# EAGLE board metronome (EAGLE 6.6.0)
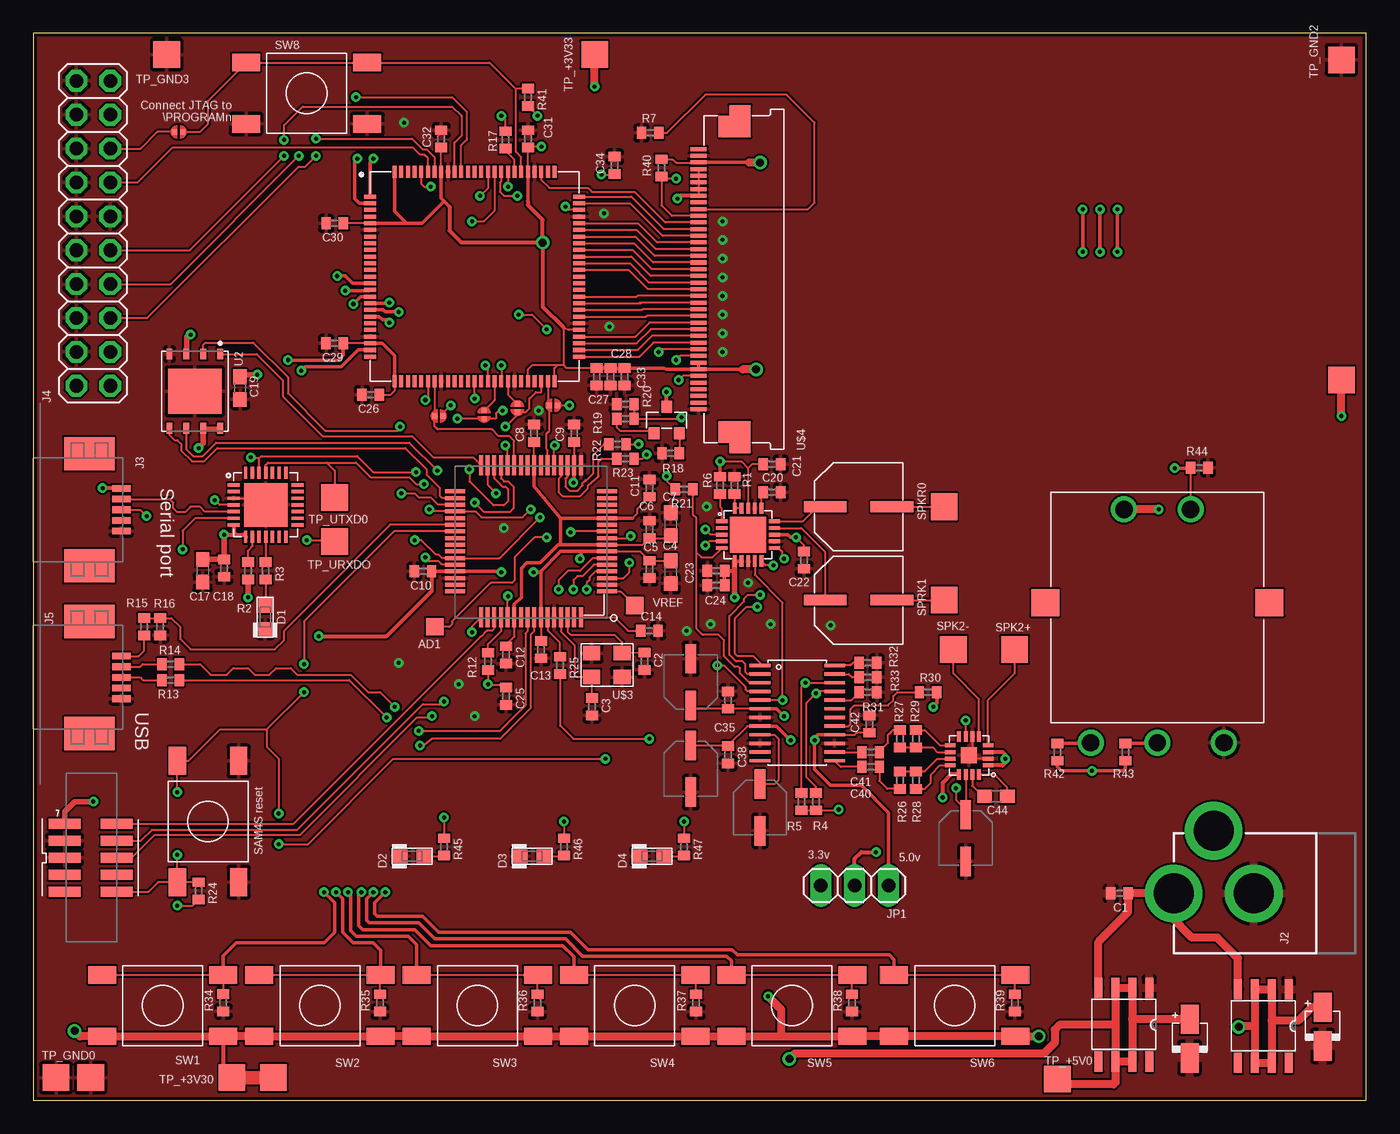
[diagram p5: board, top side]
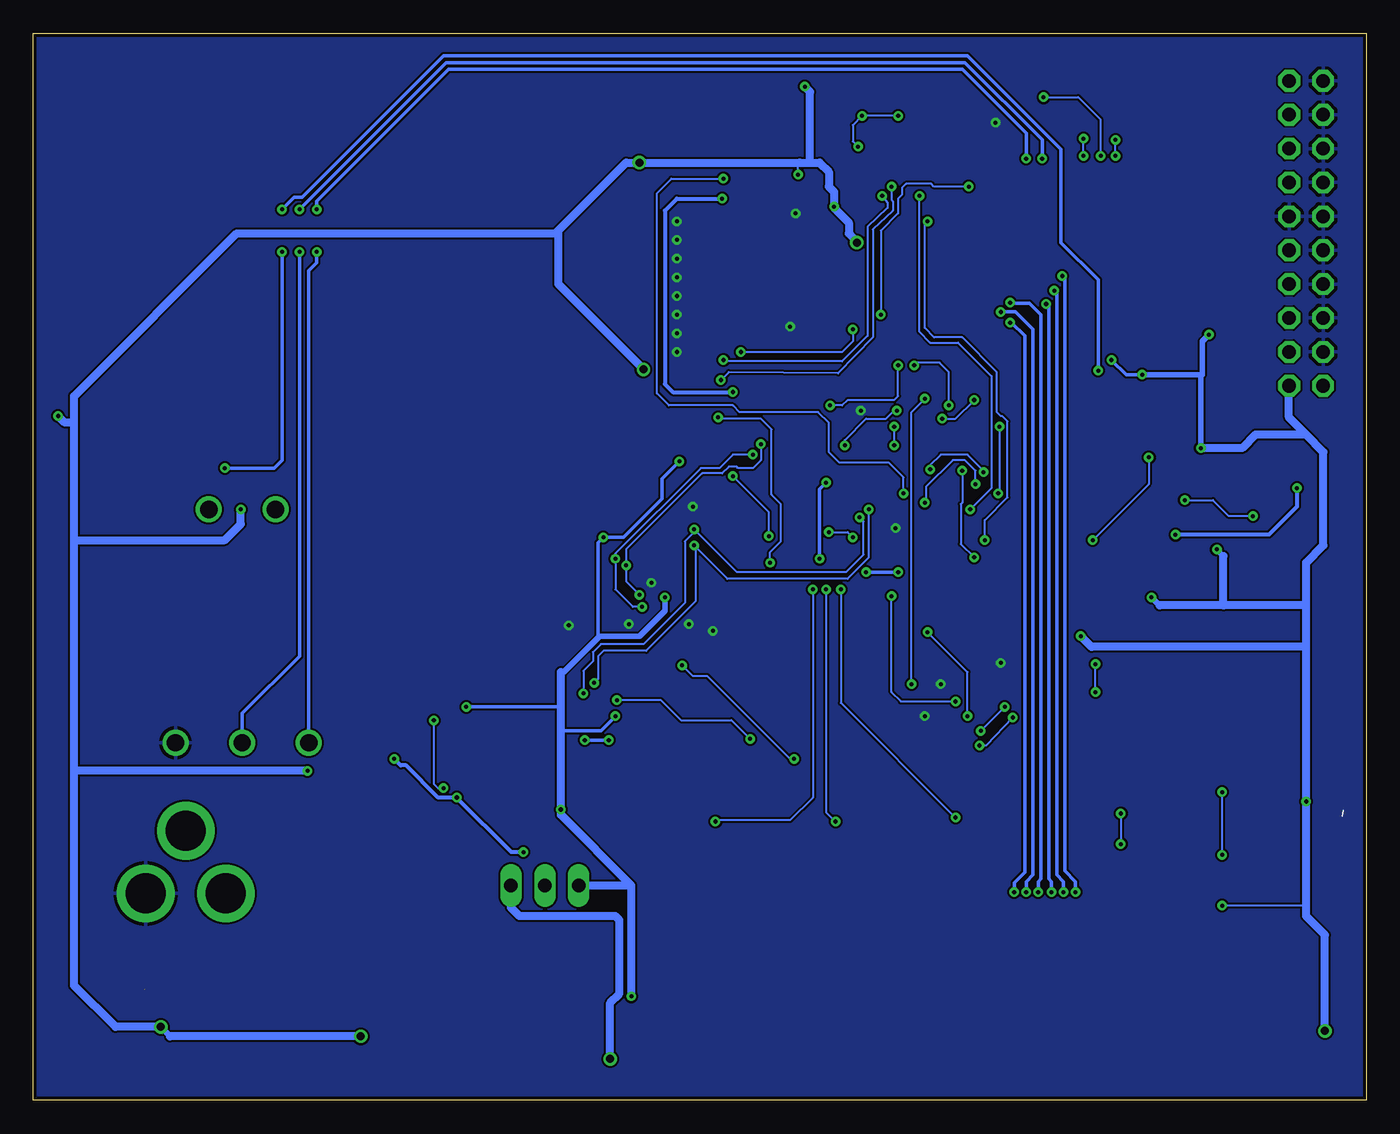
[diagram p6: board, bottom side, seen from below]

Size 99.96 x 79.99 mm. Coordinates in mm from the lower left corner, seen from the top.
Outline: 0,0 99.96,0 99.96,79.99 0,79.99 0,0
Copper layers (1*16): Top 0.035mm / dielectric 1.5mm / Bottom 0.035mm
Design rules "DFRobot_Eagle_Rule_v0.4": minimum track width 6mil, minimum drill 12mil, track to track 6mil, track to pad 6mil, pad to pad 6mil, via to via 6mil, smd to smd 0mil, copper to edge 10mil, drill to drill 10mil, minimum pad ring 12mil, minimum via ring 8mil, stop-mask expansion 2mil, vias tented up to drill 25mil, thermal gap 10mil

## Footprints (pad centres in the part's own frame; a part is rotated, then mirrored left to right if it is on the bottom)
ON_SEMICONDUCTOR_MC33269 = smd 0.6 x 1.52: P$1 0,-5.52; P$2 1.27,-5.52; P$3 2.54,-5.52; P$4 3.81,-5.52; P$5 3.81,0; P$6 2.54,0; P$7 1.27,0; P$8 0,0
TP13SQ = smd 1.3 x 1.3: TP 0,0
C0402 = smd 0.7 x 0.9: 1 -0.65,0; 2 0.65,0
C0603 = smd 1.1 x 1: 1 -0.85,0; 2 0.85,0
KEMET_T491A = smd 2.2 x 1.35: NEG 0,0; POS 2.9,0
PANASONIC_EEEHB100AR = smd 0.8 x 2.2: NEG 0,0; POS 0,-3.5
D0603 = smd 1 x 1.09: AN 0,-0.89; CATH 0,0.89
FCI_10_PIN_SMD_0.5 = smd 0.76 x 2.4: P$1 0,-3.9; P$2 0,0; P$3 1.27,-3.9; P$4 1.27,0; P$5 2.54,-3.9; P$6 2.54,0; P$7 3.81,-3.9; P$8 3.81,0; P$9 5.08,-3.9; P$10 5.08,0
POWER_JACK_PTH = drill 2.997 pad 4.318: GND 0,7.7; GNDBREAK 4.7,10.7; PWR 0,13.7
UX60SC-MB-5ST = smd 2.5 x 3.8: M$1 -4.2,3.7; M$2 4.2,3.7 | smd 0.5 x 1.4: P$1 -1.6,6.1; P$2 -0.8,6.1; P$3 0,6.1; P$4 0.8,6.1; P$5 1.6,6.1
2X10 = drill 1.016 octagon: 1 -11.43,-1.27; 2 -11.43,1.27; 3 -8.89,-1.27; 4 -8.89,1.27; 5 -6.35,-1.27; 6 -6.35,1.27; 7 -3.81,-1.27; 8 -3.81,1.27; 9 -1.27,-1.27; 10 -1.27,1.27; 11 1.27,-1.27; 12 1.27,1.27; 13 3.81,-1.27; 14 3.81,1.27; 15 6.35,-1.27; 16 6.35,1.27; 17 8.89,-1.27; 18 8.89,1.27; 19 11.43,-1.27; 20 11.43,1.27
1X03 = drill 1.016 long: 1 -2.54,0; 2 0,0; 3 2.54,0
R0402 = smd 0.7 x 0.9: 1 -0.65,0; 2 0.65,0
SB_1MM = smd 0.4 x 0.4: P$1 -0.3,0; P$2 0.3,0
TP20SQ = smd 2 x 2: TP 0,0
FSMJSMA = smd 1.3 x 2.1: P$1 -2.3,4.55; P$2 -2.3,-4.55; P$3 2.3,4.55; P$4 2.3,-4.55
ATMEL_10X10_QFP_64 = smd 1.5 x 0.3: P$1 0,0; P$2 0,-0.5; P$3 0,-1; P$4 0,-1.5; P$5 0,-2; P$6 0,-2.5; P$7 0,-3; P$8 0,-3.5; P$9 0,-4; P$10 0,-4.5; P$11 0,-5; P$12 0,-5.5; P$13 0,-6; P$14 0,-6.5; P$15 0,-7; P$16 0,-7.5; P$33 11.4,-7.5; P$34 11.4,-7; P$35 11.4,-6.5; P$36 11.4,-6; P$37 11.4,-5.5; P$38 11.4,-5; P$39 11.4,-4.5; P$40 11.4,-4; P$41 11.4,-3.5; P$42 11.4,-3; P$43 11.4,-2.5; P$44 11.4,-2; P$45 11.4,-1.5; P$46 11.4,-1; P$47 11.4,-0.5; P$48 11.4,0 | smd 0.3 x 1.5: P$17 1.95,-9.45; P$18 2.45,-9.45; P$19 2.95,-9.45; P$20 3.45,-9.45; P$21 3.95,-9.45; P$22 4.45,-9.45; P$23 4.95,-9.45; P$24 5.45,-9.45; P$25 5.95,-9.45; P$26 6.45,-9.45; P$27 6.95,-9.45; P$28 7.45,-9.45; P$29 7.95,-9.45; P$30 8.45,-9.45; P$31 8.95,-9.45; P$32 9.45,-9.45; P$49 9.45,1.95; P$50 8.95,1.95; P$51 8.45,1.95; P$52 7.95,1.95; P$53 7.45,1.95; P$54 6.95,1.95; P$55 6.45,1.95; P$56 5.95,1.95; P$57 5.45,1.95; P$58 4.95,1.95; P$59 4.45,1.95; P$60 3.95,1.95; P$61 3.45,1.95; P$62 2.95,1.95; P$63 2.45,1.95; P$64 1.95,1.95
8MA1-UDFN = smd 0.44 x 0.82: P$1 -1.905,-2.79; P$2 -0.635,-2.79; P$3 0.635,-2.79; P$4 1.905,-2.79; P$5 1.905,2.79; P$6 0.635,2.79; P$7 -0.635,2.79; P$8 -1.905,2.79 | smd 4 x 3.4: P$9 0,0
LATTICE_MACHXO_TQFP100 = smd 0.9 x 0.3: P$1 0,0; P$2 0,-0.5; P$3 0,-1; P$4 0,-1.5; P$5 0,-2; P$6 0,-2.5; P$7 0,-3; P$8 0,-3.5; P$9 0,-4; P$10 0,-4.5; P$11 0,-5; P$12 0,-5.5; P$13 0,-6; P$14 0,-6.5; P$15 0,-7; P$16 0,-7.5; P$17 0,-8; P$18 0,-8.5; P$19 0,-9; P$20 0,-9.5; P$21 0,-10; P$22 0,-10.5; P$23 0,-11; P$24 0,-11.5; P$25 0,-12; P$51 15.7,-12; P$52 15.7,-11.5; P$53 15.7,-11; P$54 15.7,-10.5; P$55 15.7,-10; P$56 15.7,-9.5; P$57 15.7,-9; P$58 15.7,-8.5; P$59 15.7,-8; P$60 15.7,-7.5; P$61 15.7,-7; P$62 15.7,-6.5; P$63 15.7,-6; P$64 15.7,-5.5; P$65 15.7,-5; P$66 15.7,-4.5; P$67 15.7,-4; P$68 15.7,-3.5; P$69 15.7,-3; P$70 15.7,-2.5; P$71 15.7,-2; P$72 15.7,-1.5; P$73 15.7,-1; P$74 15.7,-0.5; P$75 15.7,0 | smd 0.3 x 0.9: P$26 1.85,-13.85; P$27 2.35,-13.85; P$28 2.85,-13.85; P$29 3.35,-13.85; P$30 3.85,-13.85; P$31 4.35,-13.85; P$32 4.85,-13.85; P$33 5.35,-13.85; P$34 5.85,-13.85; P$35 6.35,-13.85; P$36 6.85,-13.85; P$37 7.35,-13.85; P$38 7.85,-13.85; P$39 8.35,-13.85; P$40 8.85,-13.85; P$41 9.35,-13.85; P$42 9.85,-13.85; P$43 10.35,-13.85; P$44 10.85,-13.85; P$45 11.35,-13.85; P$46 11.85,-13.85; P$47 12.35,-13.85; P$48 12.85,-13.85; P$49 13.35,-13.85; P$50 13.85,-13.85; P$76 13.85,1.85; P$77 13.35,1.85; P$78 12.85,1.85; P$79 12.35,1.85; P$80 11.85,1.85; P$81 11.35,1.85; P$82 10.85,1.85; P$83 10.35,1.85; P$84 9.85,1.85; P$85 9.35,1.85; P$86 8.85,1.85; P$87 8.35,1.85; P$88 7.85,1.85; P$89 7.35,1.85; P$90 6.85,1.85; P$91 6.35,1.85; P$92 5.85,1.85; P$93 5.35,1.85; P$94 4.85,1.85; P$95 4.35,1.85; P$96 3.85,1.85; P$97 3.35,1.85; P$98 2.85,1.85; P$99 2.35,1.85; P$100 1.85,1.85
TI_QFN_20 = smd 0.85 x 0.28: 1 -0.975,-0.975; 2 -0.975,-1.475; 3 -0.975,-1.975; 4 -0.975,-2.475; 5 -0.975,-2.975; 11 2.975,-2.975; 12 2.975,-2.475; 13 2.975,-1.975; 14 2.975,-1.475; 15 2.975,-0.975 | smd 0.28 x 0.85: 6 0,-3.95; 7 0.5,-3.95; 8 1,-3.95; 9 1.5,-3.95; 10 2,-3.95; 16 2,0; 17 1.5,0; 18 1,0; 19 0.5,0; 20 0,0 | smd 2.7 x 2.7: GND_PAD 1,-1.975
ECS_ECX-32 = smd 1.3 x 1.1: P$1 0,-1.8; P$2 2.3,-1.8; P$3 2.3,0; P$4 0,0
40_PIN_MOLEX_FFC = smd 1.6 x 0.8: NC@0 -1.7,-1.9; NC@2 21.2,-1.9 | smd 2.4 x 1.6: NC@1 -2.1,-3.1; NC@3 21.6,-3.1 | smd 0.3 x 1.2: P$1 0,0; P$2 0.5,0; P$3 1,0; P$4 1.5,0; P$5 2,0; P$6 2.5,0; P$7 3,0; P$8 3.5,0; P$9 4,0; P$10 4.5,0; P$11 5,0; P$12 5.5,0; P$13 6,0; P$14 6.5,0; P$15 7,0; P$16 7.5,0; P$17 8,0; P$18 8.5,0; P$19 9,0; P$20 9.5,0; P$21 10,0; P$22 10.5,0; P$23 11,0; P$24 11.5,0; P$25 12,0; P$26 12.5,0; P$27 13,0; P$28 13.5,0; P$29 14,0; P$30 14.5,0; P$31 15,0; P$32 15.5,0; P$33 16,0; P$34 16.5,0; P$35 17,0; P$36 17.5,0; P$37 18,0; P$38 18.5,0; P$39 19,0; P$40 19.5,0
DIODES_INCORPORATED_SOT23 = smd 0.8 x 0.9: P$1 -0.95,-2; P$2 0.95,-2; P$3 0,0
PANASONIC_EEEFT0JXXX = smd 0.8 x 3.2: NEG 0,0.3; POS 0,-4.7
SILABS_QFN28 = smd 3.25 x 3.25: GND_PAD 2.4,-1.5 | smd 0.9 x 0.25: P$1 0,0; P$2 0,-0.5; P$3 0,-1; P$4 0,-1.5; P$5 0,-2; P$6 0,-2.5; P$7 0,-3; P$15 4.8,-3; P$16 4.8,-2.5; P$17 4.8,-2; P$18 4.8,-1.5; P$19 4.8,-1; P$20 4.8,-0.5; P$21 4.8,0 | smd 0.25 x 0.9: P$8 0.9,-3.9; P$9 1.4,-3.9; P$10 1.9,-3.9; P$11 2.4,-3.9; P$12 2.9,-3.9; P$13 3.4,-3.9; P$14 3.9,-3.9; P$22 3.9,0.9; P$23 3.4,0.9; P$24 2.9,0.9; P$25 2.4,0.9; P$26 1.9,0.9; P$27 1.4,0.9; P$28 0.9,0.9
TI_PW_TSSOP_24 = smd 0.25 x 1.55: P$1 0,-5.6; P$2 0.65,-5.6; P$3 1.3,-5.6; P$4 1.95,-5.6; P$5 2.6,-5.6; P$6 3.25,-5.6; P$7 3.9,-5.6; P$8 4.55,-5.6; P$9 5.2,-5.6; P$10 5.85,-5.6; P$11 6.5,-5.6; P$12 7.15,-5.6; P$13 7.15,0; P$14 6.5,0; P$15 5.85,0; P$16 5.2,0; P$17 4.55,0; P$18 3.9,0; P$19 3.25,0; P$20 2.6,0; P$21 1.95,0; P$22 1.3,0; P$23 0.65,0; P$24 0,0
MAXIM_16_TQFN_T1633-5 = smd 0.8 x 0.3: P$1 0,0; P$2 0,-0.5; P$3 0,-1; P$4 0,-1.5; P$9 2.85,-1.5; P$10 2.85,-1; P$11 2.85,-0.5; P$12 2.85,0 | smd 0.3 x 0.8: P$5 0.675,-2.175; P$6 1.175,-2.175; P$7 1.675,-2.175; P$8 2.175,-2.175; P$13 2.175,0.675; P$14 1.675,0.675; P$15 1.175,0.675; P$16 0.675,0.675 | smd 1.2 x 1.2: P$17 1.425,-0.75
BOURNS_PEC16-4XXXF-SXXXX = drill 1.3: A -5,-10.5; B 0,-10.5; C 5,-10.5; D -2.5,7; E 2.5,7 | smd 2.1 x 2: NC1 -8.4,0; NC2 8.4,0

## Placement (x,y rotation side)
3.3_V_REG  MC33269D-3.3GOS-ND  [ON_SEMICONDUCTOR_MC33269]  94.15,2.81 180 top
5.0_V_REG  MC33269D-5.0GOS-ND  [ON_SEMICONDUCTOR_MC33269]  83.69,2.91 180 top
AD1  TPSQTP13SQ  [TP13SQ]  30.1,35.5 180 top
C1  330nF  [C0402]  81.45,15.51 180 top
C2  16pF  [C0402]  45.83,32.92 270 top
C3  16pF  [C0402]  41.9,29.51 270 top
C4  4.7uF  [C0603]  47.8,39.6 270 top
C5  100nF  [C0402]  46.2,39.8 270 top
C6  100nF  [C0402]  46.2,42.8 90 top
C7  2.2uF  [C0603]  47.8,43.2 90 top
C8  100nF  [C0402]  37.57,50.02 90 top
C9  100nF  [C0402]  40.57,50.01 90 top
C10  100nF  [C0402]  29.22,39.65 180 top
C11  100nF  [C0402]  46.2,45.9 90 top
C12  100nF  [C0402]  35.47,33.39 270 top
C13  100nF  [C0402]  38.07,33.79 270 top
C14  100nF  [C0402]  46.2,35.2 0 top
C15  KEMET_T491A  [KEMET_T491A]  86.73,3.18 90 top
C16  KEMET_T491A  [KEMET_T491A]  96.69,4.08 90 top
C17  2.2uF  [C0603]  12.7,39.7 270 top
C18  100nF  [C0402]  14.3,39.9 270 top
C19  2.2uF  [C0603]  15.5,53.4 270 top
C20  4.7uF  [C0402]  55.4,45.6 0 top
C21  4.7uF  [C0402]  55.4,47.7 180 top
C22  4.7uF  [C0402]  57.8,40.5 90 top
C23  1uF  [C0402]  51.2,39.7 0 top
C24  100nF  [C0402]  51.2,38.6 0 top
C25  22pF  [C0402]  35.47,30.29 270 top
C26  100nF  [C0402]  25.3,52.9 180 top
C27  100nF  [C0402]  42.26,54.25 270 top
C28  100nF  [C0402]  43.3,54.25 270 top
C29  100nF  [C0402]  22.6,56.75 180 top
C30  100nF  [C0402]  22.61,65.75 180 top
C31  100nF  [C0402]  37.09,72.07 90 top
C32  100nF  [C0402]  30.59,72.07 90 top
C33  100nF  [C0402]  44.34,54.24 270 top
C34  100nF  [C0402]  43.6,70.1 90 top
C35  1uF  [C0402]  52.1,30 90 top
C36  10uF  [PANASONIC_EEEHB100AR]  49.3,33.1 0 top
C37  10uF  [PANASONIC_EEEHB100AR]  49.3,23.1 180 top
C38  1uF  [C0402]  52.1,25.9 270 top
C39  10uF  [PANASONIC_EEEHB100AR]  54.5,20.2 180 top
C40  .33uF  [C0402]  62.8,25 0 top
C41  .33uF  [C0402]  62.8,26.1 0 top
C42  1uF  [C0402]  62.7,28.2 90 top
C43  10uF  [PANASONIC_EEEHB100AR]  69.93,17.91 180 top
C44  4.7uF  [C0603]  72.2,22.8 180 top
D1  BLUE  [D0603]  17.4,36.2 180 top
D2  BLUE  [D0603]  28.4,18.3 90 top
D3  BLUE  [D0603]  37.4,18.3 90 top
D4  BLUE  [D0603]  46.4,18.3 90 top
J1  FCI_CORTEX_SWD_CONNECTOR  [FCI_10_PIN_SMD_0.5]  6.25,20.72 270 top
J2  POWER_JACKPTH  [POWER_JACK_PTH]  99.23,15.51 90 top
J3  MINI_USB_B  [UX60SC-MB-5ST]  0.5,44.27 270 top
J4  [2X10]  4.5,65 90 top
J5  MINI_USB_B  [UX60SC-MB-5ST]  0.5,31.7 270 top
JP1  [1X03]  61.6,16.1 180 top
R1  10kOhm  [R0402]  52.6,46.1 90 top
R2  1kOhm  [R0402]  16.1,39.7 270 top
R3  100Ohm  [R0402]  17.42,39.7 270 top
R4  2kOhm  [R0402]  58.7,22.4 270 top
R5  2kOhm  [R0402]  57.6,22.4 270 top
R6  10kOhm  [R0402]  51.5,46.1 270 top
R7  1kOhm  [R0402]  46.26,72.54 0 top
R12  22Ohm  [R0402]  34.1,32.9 270 top
R13  27Ohm  [R0402]  10.3,31.5 180 top
R14  27Ohm  [R0402]  10.3,32.7 180 top
R15  27kOhm  [R0402]  8.3,35.5 270 top
R16  47kOhm  [R0402]  9.5,35.5 90 top
R17  2kOhm  [R0402]  35.4,72 270 top
R18  100Ohm  [R0402]  47.8,48.5 0 top
R19  100Ohm  [R0402]  44.4,51.1 0 top
R20  100kOhm  [R0402]  44.4,52.2 180 top
R21  22Ohm  [R0402]  48.8,45.8 180 top
R22  22Ohm  [R0402]  43.8,49.2 180 top
R23  22Ohm  [R0402]  44.4,48.1 180 top
R24  10kOhm  [R0402]  12.4,15.7 270 top
R25  22Ohm  [R0402]  39.5,32.6 270 top
R26  10kOhm  [R0402]  65,24 270 top
R27  10kOhm  [R0402]  65,27.1 90 top
R28  20kOhm  [R0402]  66.2,24 270 top
R29  20kOhm  [R0402]  66.2,27.1 90 top
R30  10kOhm  [R0402]  67.1,30.6 0 top
R31  220kOhm  [R0402]  62.6,30.6 0 top
R32  10kOhm  [R0402]  62.6,32.8 0 top
R33  10kOhm  [R0402]  62.6,31.7 0 top
R34  10kOhm  [R0402]  14.25,7.31 90 top
R35  10kOhm  [R0402]  26,7.3 90 top
R36  10kOhm  [R0402]  37.8,7.3 90 top
R37  10kOhm  [R0402]  49.7,7.3 90 top
R38  10kOhm  [R0402]  61.4,7.3 90 top
R39  10kOhm  [R0402]  73.6,7.3 90 top
R40  10kOhm  [R0402]  47.1,69.9 90 top
R41  10kOhm  [R0402]  37.1,75.2 270 top
R42  10kOhm  [R0402]  76.8,26.1 270 top
R43  10kOhm  [R0402]  81.9,26.1 270 top
R44  10kOhm  [R0402]  87.45,47.41 180 top
R45  100Ohm  [R0402]  30.8,19 270 top
R46  100Ohm  [R0402]  39.8,19 270 top
R47  100Ohm  [R0402]  48.8,19 270 top
SB1  SB_1MM  [SB_1MM]  30.4,51.3 0 top
SB2  SB_1MM  [SB_1MM]  33.8,51.4 90 top
SB3  SB_1MM  [SB_1MM]  39,52.1 0 top
SB4  SB_1MM  [SB_1MM]  36.3,51.9 90 top
SB5  SB_1MM  [SB_1MM]  10.9,72.6 180 top
SPK2+  TPSQTP20SQ  [TP20SQ]  73.6,33.8 180 top
SPK2-  TPSQTP20SQ  [TP20SQ]  69,33.8 180 top
SPKR0  TPSQTP20SQ  [TP20SQ]  68.3,44.5 90 top
SPRK1  TPSQTP20SQ  [TP20SQ]  68.3,37.5 90 top
SW1  [FSMJSMA]  9.7,7.1 90 top
SW2  [FSMJSMA]  21.5,7.1 90 top
SW3  [FSMJSMA]  33.3,7.1 90 top
SW4  [FSMJSMA]  45.1,7.1 90 top
SW5  [FSMJSMA]  56.9,7.1 90 top
SW6  [FSMJSMA]  69.1,7.1 90 top
SW7  [FSMJSMA]  13.1,20.9 180 top
SW8  [FSMJSMA]  20.5,75.5 270 top
TP_+3V30  TPSQTP20SQ  [TP20SQ]  14.9,1.7 0 top
TP_+3V31  TPSQTP20SQ  [TP20SQ]  18,1.7 0 top
TP_+3V32  TPSQTP20SQ  [TP20SQ]  98.1,54 90 top
TP_+3V33  TPSQTP20SQ  [TP20SQ]  42.1,78.4 180 top
TP_+5V0  TPSQTP20SQ  [TP20SQ]  76.8,1.6 0 top
TP_GND0  TPSQTP20SQ  [TP20SQ]  1.7,1.7 0 top
TP_GND1  TPSQTP20SQ  [TP20SQ]  4.3,1.7 0 top
TP_GND2  TPSQTP20SQ  [TP20SQ]  98.1,78 90 top
TP_GND3  TPSQTP20SQ  [TP20SQ]  10,78.4 180 top
TP_URXDO  TPSQTP20SQ  [TP20SQ]  22.6,41.9 180 top
TP_UTXD0  TPSQTP20SQ  [TP20SQ]  22.6,45.2 180 top
U1  ATSAMD4S2BA-AU  [ATMEL_10X10_QFP_64]  43.02,38.15 180 top
U2  [8MA1-UDFN]  12.11,53.16 180 top
U$1  LATTICE_LCMXO2-640HC-4TG100C  [LATTICE_MACHXO_TQFP100]  25.24,67.75 0 top
U$2  TI_PCM1774  [TI_QFN_20]  52.61,44.38 0 top
U$3  ECS_ECS-120-20-33-CKM-TR  [ECS_ECX-32]  44.16,31.73 180 top
U$4  40_PIN_MOLEX_FFC  [40_PIN_MOLEX_FFC]  49.9,51.81 90 top
U$5  DIODES_INCORPORATED_2N7002-7-F  [DIODES_INCORPORATED_SOT23]  47.5,52 0 top
U$6  330uF  [PANASONIC_EEEFT0JXXX]  64.1,44.5 270 top
U$7  SILABS_CP2102  [SILABS_QFN28]  15.03,46.14 0 top
U$8  330uF  [PANASONIC_EEEFT0JXXX]  64.1,37.5 270 top
U$9  TI_PCM1789  [TI_PW_TSSOP_24]  60.1,32.6 270 top
U$10  MAXIM_MAX_98307  [MAXIM_16_TQFN_T1633-5]  71.6,25.1 180 top
U$11  BOURNS_PEC16-4215F-S0024  [BOURNS_PEC16-4XXXF-SXXXX]  84.3,37.3 0 top
VREF  TPSQTP13SQ  [TP13SQ]  45.1,37.1 0 top

## Tracks (layer width: path | path; a pad name or v marks a point on that pad's centre or on a via)
!DISP_READ!
  Top 0.152: U$1.P$53 45.25,56.75 46.31,57.81 U$4.P$13
!DISP_RESET!  (via drill 0.3)
  Top 0.152: U$4.P$30 47.89,66.31 47.1,67.1 R40.1 47.25,69.1 v48.2,69.1 | U1.P$31 34.07,46.13 v34.7,45.5
  Bottom 0.152: v34.7,45.5 34.7,46.7 35.8,47.8 39.5,47.8 40.3,48.6 40.3,50.8 41.1,51.6 47,51.6 47.5,52.1 52.3,52.1 53.2,53 53.2,68 52.1,69.1 v48.2,69.1
!DISP_WRITE!
  Top 0.152: U$4.P$12 46.41,57.31 45.35,56.25 U$1.P$52
+3V3  (via drill 0.3, 0.6)  (1 unrouted)
  Top 0.152: U$7.P$6 12.14,43.64 11.2,42.7 v11.2,41.3 | C9.1 U1.P$18 | U1.P$18 | C10.1 | U1.P$58 C13.1 | C4.1 C5.1 45.5,41.15 U1.P$7 | v10.8,14.6 11.95,14.6 R24.2 | U$1.P$93 C32.1 | U$1.P$80 C31.1 37.16,71.5 v38.1,71.5 | U$1.P$5 C30.1 | C30.1 | U$1.P$23 C29.1 | C26.1 26.8,52.9 27.09,53.19 U$1.P$26 | C27.1 40,54.9 39.8,55.1 | 39.8,55.1 39.3,55.1 | U$1.P$50 39.09,54.89 39.3,55.1 | 39.3,55.1 37.4,55.1 37.09,54.79 U$1.P$46 | 39.8,55.1 39.8,57.9 40.15,57.75 U$1.P$55 | U$1.P$73 40.15,66.75 v39.9,67 | v42.6,69.4 43.55,69.4 C34.1 | R17.1 35.4,73.5 v35.1,73.8 | R41.2 37.1,74.5 v37.8,73.8 | R40.2 47.95,70.55 48.2,70.3 U$4.P$38 | v51.5,47.9 53.1,47.9 53.6,47.4 | 53.6,47.4 U$2.18 | U$9.P$6 C35.1 49.55,29.35 C36.POS | R5.2 R4.2 60.35,21.75 v60.4,21.8 | C21.2 53.9,47.7 53.6,47.4 | 57.3,42.1 v57.2,42.2 57.8,41.6 C22.2
  Top 0.254: U$4.P$38 53.69,70.31 53.7,70.3 | U$4.P$7 53.19,54.81 53.2,54.8 | U$4.P$8 U$4.P$7 | C33.1 47.29,54.89 47.5,54.8 U$4.P$7 | U$1.P$80 37.09,67.41 | U$1.P$93 30.59,67.61 30.8,67.4 | 30.8,67.4 31.2,67 | U$1.P$5 28,65.75 | 28,65.75 29.15,65.75 30.8,67.4 | U$1.P$26 27.09,55.81 26.15,56.75 U$1.P$23 | U$1.P$100 27.09,66.66 28,65.75 | U1.P$58 38.07,39.67 | 38.07,39.67 39.55,41.15 41.07,41.15 | U1.P$7 41.07,41.15 | 41.07,41.15 41.07,40.67 v41,40.6 | U1.P$18 40.57,46.37 v40.5,46.3 | v51.5,47.9 R6.1 | C29.1 23.25,55.85 22.9,55.5 v19.1,55.5 | U$2.6 U$2.7 | v57.2,42.2 56.8,42.2 56.6,42.4 U$2.13 | U$9.P$6 55.75,29.35 v56.3,28.8 | C10.1 U1.P$45 35.05,39.65 v35.1,39.6 | R42.2 76.8,25 77.1,24.7 v79.4,24.7 81.7,24.7 81.9,24.9 R43.2 | R30.2 67.75,29.75 v67.5,29.5 | v37.5,39.6 38,39.6 38.07,39.67
  Top 0.305: 92.9,8.35 3.3_V_REG.P$2 | 3.3_V_REG.P$6 91.79,2.81 91.8,2.8 | 3.3_V_REG.P$7 | 91.61,8.31 91.7,8.4 | C27.1 C28.1 C33.1 | U2.P$7 U2.P$8 | SW1.P$2 14.25,2.35 TP_+3V30.TP | 39.8,57.9 38.2,59.5 v38.2,64.3 | 31.2,67 31.2,65.2 32.1,64.3 v38.2,64.3 | 37.09,67.41 37.09,67.11 38.2,66 v38.2,64.3 | v21.4,34.8 26.5,34.8 29.87,38.17 C10.1 | 52.6,39.8 52.5,39.7 C23.2 C24.2
  Top 0.406: 90.45,5.55 v90.4,5.5 | SW3.P$2 SW4.P$1 | U2.P$7 12.74,49.24 v12.4,48.9 | v11.8,57.4 11.7,57.4 11.5,57.2 11.5,55.98 U2.P$3 | v16.8,54.4 15.65,54.4 C19.1 | J1.P$1 2.35,21.65 3.1,22.4 v4.5,22.4
  Top 0.41: v16.1,37.7 R2.2 | v52.6,37.7 52.6,39.8 U$2.6
  Top 0.61: 91.61,5.55 91.61,8.31 92.86,8.31 3.3_V_REG.P$2 92.88,6 | 91.61,5.55 3.3_V_REG.P$6 3.3_V_REG.P$7 92.9,2.8 | 92.88,6 3.3_V_REG.P$7 | C16.POS 95.88,6.98 94.9,6 92.88,6 | 91.61,5.55 90.45,5.55 | v75.4,4.8 SW6.P$2 SW6.P$1 SW5.P$2 56.1,4.8 | 56.1,4.8 SW5.P$1 SW4.P$2 SW3.P$2 SW3.P$1 SW2.P$2 SW2.P$1 SW1.P$2 SW1.P$1 3.5,4.8 v3.1,5.2 | v54.5,70.3 53.7,70.3 | v54.2,54.8 53.2,54.8 | v42.1,76 TP_+3V33.TP | v98.1,51.3 TP_+3V32.TP | 56.1,4.8 56.1,6.8 v55.1,7.8 | v84.4,44.3 U$11.D
  Top 1: TP_+3V30.TP TP_+3V31.TP
  Bottom 0.152: 4.5,14.6 v10.8,14.6 | v35.1,73.8 v37.8,73.8 38.5,73.1 38.5,71.9 v38.1,71.5 | v42.6,69.4 42.6,70.2 42.5,70.3
  Bottom 0.254: v35.1,39.6 v37.5,39.6 | v41,40.6 41,45.8 v40.5,46.3 | v51.5,47.9 52.8,46.6 52.8,45.1 55.7,42.2 v57.2,42.2 57.6,41.8 57.6,34.9 57.5,34.8 | v16.8,54.4 18,54.4 v19.1,55.5 | 60.4,27.7 57.4,27.7 v56.3,28.8 | v67.5,29.5 60.4,29.5
  Bottom 0.406: 89.7,4.8 v90.4,5.5 | 10.7,40.8 v11.2,41.3 | 5.8,53.54 J4.1 | v11.8,57.4 12.3,56.9 12.3,54.4 12.4,54.4 | 12.4,54.4 v16.8,54.4 | 12.4,54.4 v12.4,48.9
  Bottom 0.41: 15.5,37.1 v16.1,37.7 | 60.4,32.1 60.2,32.1 57.5,34.8 54.5,34.8 52.6,36.7 v52.6,37.7
  Bottom 0.61: v75.4,4.8 89.7,4.8 | v3.1,5.2 3.1,12.4 4.5,13.8 4.5,14.6 v4.5,22.4 4.5,34 | 4.5,34 4.5,37.1 | 4.5,37.1 10.7,37.1 | 10.7,37.1 15.5,37.1 | 10.7,37.1 10.7,40.8 | 4.5,37.1 4.5,40.3 3.2,41.6 3.2,48.6 4.5,49.9 | 4.5,49.9 5.8,51.2 5.8,53.54 | 4.5,49.9 8.3,49.9 9.3,48.9 v12.4,48.9 | v90.4,5.5 93.8,5.5 96.9,8.6 96.9,24.8 | 96.9,24.8 96.9,42 | 96.9,42 96.9,50.8 | 96.9,50.8 96.9,52.8 84.7,65 60.8,65 60.6,65.2 | 60.6,65.2 55.5,70.3 v54.5,70.3 42.5,70.3 41.7,70.3 | 60.6,65.2 60.6,61.2 v54.2,54.8 | 41.7,70.3 41,70.3 40.3,69.6 40.3,68.5 39.9,68.1 v39.9,67 39.9,66.9 38.8,65.8 38.8,65 v38.2,64.3 | 41.7,70.3 41.7,75.6 v42.1,76 | 96.9,50.8 97.6,50.8 v98.1,51.3 | v55.1,7.8 55.1,16.1 | 55.1,16.1 60.4,21.4 v60.4,21.8 60.4,27.7 60.4,29.5 60.4,32.1 | 4.5,34 20.6,34 v21.4,34.8 | 55.1,16.1 JP1.3 | 96.9,42 85.6,42 84.4,43.2 v84.4,44.3 | v79.4,24.7 96.8,24.7 96.9,24.8
+5V0  (via drill 0.3, 0.6)
  Top 0.152: U$9.P$8 53.55,28.05 52.1,26.6 C38.1 52.05,26.6 C37.POS | C42.1 61.75,27.55 61.6,27.4 U$9.P$16
  Top 0.254: U$9.P$8 55.75,28.05 v56.8,27 | U$9.P$16 58.8,27.4 58.6,27.2 v58.6,27 58.6,24.8 59.8,23.6 62.1,23.6 64.14,21.56 JP1.1
  Top 0.61: 5.0_V_REG.P$6 5.0_V_REG.P$7 | 81.15,5.66 5.0_V_REG.P$3 5.0_V_REG.P$2 82.42,6.1 | 81.15,5.66 5.0_V_REG.P$6 | 82.42,6.1 5.0_V_REG.P$7 82.4,2.9 82.4,2.7 | C15.POS 85.02,6.08 85,6.1 82.42,6.1 | 5.0_V_REG.P$6 81.15,1.35 81,1.2 77.2,1.2 | 77.2,1.2 TP_+5V0.TP | 77.2,1.2 77.1,1.2 76.8,1.5 | 81.15,5.66 76.95,5.66 76.6,5.3 76.6,4.3 75.8,3.5 57.1,3.5 v56.7,3.1
  Bottom 0.254: v56.8,27 v58.6,27
  Bottom 0.61: v56.7,3.1 56.7,7.3 56,8 56,13.5 56.3,13.8 63.5,13.8 64.14,14.44 JP1.1
CPLD_JTAG_TCK  (via drill 0.3)
  Top 0.152: J4.9 11.73,63.73 v18.8,70.8 | v18.8,72 18.8,73.1 20.2,74.5 31.4,74.5 32.1,73.8 32.1,72.3 31.59,71.79 U$1.P$91
  Bottom 0.152: v18.8,70.8 v18.8,72
CPLD_JTAG_TDI  (via drill 0.3)
  Top 0.152: J4.5 8.55,58.65 19.9,70 20.4,70 v21.2,70.8 | v21.2,72.1 28.4,72.1 29.2,71.3 29.5,71.3 30.1,70.7 U$1.P$94
  Bottom 0.152: v21.2,70.8 v21.2,72.1
CPLD_JTAG_TDO
  Top 0.152: U$1.P$95 29.59,70.61 29.3,70.9 29,70.9 28.5,71.4 10.4,71.4 7.81,68.81 J4.13
CPLD_JTAG_TMS  (via drill 0.3)
  Top 0.152: J4.7 10.29,61.19 v19.9,70.8 | U$1.P$90 32.09,71.59 32.5,72 32.5,74.1 31.4,75.2 v24.2,75.2
  Bottom 0.152: v19.9,70.8 19.9,73.5 21.6,75.2 v24.2,75.2
CPLD_PROGRAMN
  Top 0.152: SB5.P$1 12.5,72.6 13.1,73.2 13.1,74.95 SW8.P$2 SW8.P$1 34.2,77.8 36.2,75.8 | U$1.P$81 36.59,70.71 36.2,71.1 36.2,75.8 | R41.1 36.25,75.85 36.2,75.8
CPLD_SYS_CLK  (via drill 0.3)
  Top 0.152: R12.2 v34.1,31.2 34.15,31.15 35.26,31.15 C25.1 | v33.1,52.6 U$1.P$38
  Bottom 0.152: v34.1,31.2 34.1,51.6 v33.1,52.6
D+  (via drill 0.3)
  Top 0.152: U1.P$57 37.57,35.17 37.3,34.9 37.3,29.4 35,27.1 29.9,27.1 29.3,26.6 v29,26.6 | R13.1 23.7,31.5 v26.5,28.7
  Bottom 0.152: v29,26.6 28.5,26.6 v26.5,28.7
D-  (via drill 0.3)
  Top 0.152: v28.9,27.7 35,27.7 36.9,29.6 36.9,35 37.07,35.17 U1.P$56 | R14.1 12.5,32.7 13.3,31.9 14.5,31.9 15,32.4 16.1,32.4 16.6,31.9 17.7,31.9 18.2,32.4 19.3,32.4 19.8,31.9 23.8,31.9 25.1,30.6 26,30.6 v27.1,29.5
  Bottom 0.152: v27.1,29.5 v28.9,27.7
DISP_CHIP_SELECT  (via drill 0.3)
  Top 0.152: U$1.P$96 29.09,68.71 29.3,68.5 v29.8,68.5 | v36.4,58.9 37.4,58.9 v38.5,57.8 | U$4.P$10 47.11,56.31 v46.9,56.1
  Bottom 0.152: v29.8,68.5 32.4,68.5 32.6,68.7 34.5,68.7 34.8,68.4 34.8,67.9 35.1,67.6 35.1,66.5 36.4,65.2 v36.4,58.9 | v38.5,57.8 38.5,56.9 39.3,56.1 v46.9,56.1
DISP_DATA_COMMAND
  Top 0.152: U$1.P$51 45.45,55.75 46.51,56.81 U$4.P$11
DISP_DB0
  Top 0.152: U$1.P$54 45.15,57.25 46.21,58.31 U$4.P$14
DISP_DB1
  Top 0.152: U$4.P$15 46.01,58.81 45.95,58.75 U$1.P$57
DISP_DB2
  Top 0.152: U$4.P$16 45.71,59.31 45.65,59.25 U$1.P$58
DISP_DB3
  Top 0.152: U$4.P$17 45.6,59.81 | 45.6,59.81 45.51,59.81 45.5,59.8 | U$1.P$59 45.54,59.75 45.6,59.81
DISP_DB4
  Top 0.152: U$4.P$18 45.31,60.31 45.25,60.25 U$1.P$60
DISP_DB5
  Top 0.152: U$4.P$19 46.09,60.81 44.65,62.25 U$1.P$64
DISP_DB6
  Top 0.152: U$4.P$20 46.19,61.31 44.75,62.75 U$1.P$65
DISP_DB7
  Top 0.152: U$1.P$66 44.85,63.25 46.29,61.81 U$4.P$21
DISP_DB8
  Top 0.152: U$1.P$67 44.95,63.75 46.39,62.31 U$4.P$22
DISP_DB9
  Top 0.152: U$1.P$68 45.05,64.25 46.49,62.81 U$4.P$23
DISP_DB10
  Top 0.152: U$1.P$69 45.15,64.75 46.59,63.31 U$4.P$24
DISP_DB11
  Top 0.152: U$4.P$25 46.69,63.81 45.25,65.25 U$1.P$70
DISP_DB12
  Top 0.152: U$1.P$71 45.35,65.75 46.79,64.31 U$4.P$26
DISP_DB13
  Top 0.152: U$4.P$27 47.19,64.81 44.75,67.25 U$1.P$74
DISP_DB14
  Top 0.152: U$4.P$28 47.29,65.31 44.85,67.75 U$1.P$75
DISP_DB15
  Top 0.152: U$4.P$29 47.39,65.81 45.1,68.1 41.9,68.1 41.6,68.4 38.7,68.4 38.09,69.01 U$1.P$78
DISP_FMARK  (via drill 0.3)
  Top 0.152: U$1.P$84 35.09,68.89 35,68.8 35,68.1 35.3,67.8 v36.3,67.8 | U$4.P$9 48.51,55.81 v48.2,55.5
  Bottom 0.152: v36.3,67.8 35.9,67.3 35.9,66.9 37.4,65.5 37.4,57.3 39.3,55.4 48.1,55.4 v48.2,55.5
DISP_ID  (via drill 0.3)
  Top 0.152: U$1.P$83 v35.59,68.51 v35.6,68.5 | 48.6,54.2 v48.4,54 48.71,54.31 U$4.P$6
  Bottom 0.152: v35.6,68.5 35.6,67.5 35.5,67.4 35.5,66.7 37,65.3 37,57.2 39.6,54.5 47.8,54.6 v48.4,54
DISP_SPI_CS  (via drill 0.3)
  Top 0.152: U1.P$28 35.57,48.93 v35.4,49.1 | U$1.P$48 38.1,53.1 37.7,53.1 37.2,52.6 37.2,51.9 36.9,51.6 SB4.P$1 36.3,51.4 v35.4,50.5
  Bottom 0.152: v35.4,50.5 v35.4,49.1
DISP_SPI_MISO
  Top 0.152: U1.P$27 36.07,49.43 35.7,49.8 34.9,49.8 34.4,50.3 30.3,50.3 30.1,50.5 SB1.P$1 U$1.P$32
DISP_SPI_MOSI
  Top 0.152: U1.P$22 38.57,48.73 38.5,48.8 38.5,50 38.7,50.2 SB3.P$1 38.59,52.21 U$1.P$49
DISP_SPI_SPCK  (via drill 0.3)
  Top 0.152: U1.P$21 39.07,49.07 v39.1,49.1 | v35.2,51.7 34.9,51.7 34.7,51.5 34.7,51.1 SB2.P$1 v31.8,51.1 | U$1.P$31 29.59,52.69 v29.4,52.5
  Bottom 0.152: v39.1,49.1 39.1,49.5 37.5,51.1 36,51.1 35.4,51.7 v35.2,51.7 | v31.8,51.1 30.8,51.1 v29.4,52.5
ENC_A  (via drill 0.3)
  Top 0.254: R42.1 79.25,26.75 U$11.A | U$1.P$1 25.24,70.34 v25.5,70.6 | v78.7,66.8 v78.7,63.6
  Bottom 0.254: v25.5,70.6 25.5,72.5 30.3,77.3 68.8,77.3 78.7,67.4 v78.7,66.8 | v78.7,63.6 78.7,62.8 79.3,62.2 U$11.A
ENC_B  (via drill 0.3)
  Top 0.254: R43.1 84.25,26.75 U$11.B | U$1.P$2 24.45,67.25 24.1,67.6 24.1,70.4 v24.3,70.6 | v80,66.8 v80,63.6
  Bottom 0.254: v24.3,70.6 24.3,72 30.1,77.8 69,77.8 v80,66.8 | v80,63.6 80,33.3 84.3,29 U$11.B
ENC_SWITCH  (via drill 0.3)
  Top 0.152: U$11.E R44.2
  Top 0.254: U$1.P$24 24.35,56.25 23.1,55 20.4,55 v20.1,54.7 | v81.3,66.8 v81.3,63.6 | v85.6,47.4 86.79,47.4 R44.2
  Bottom 0.254: v20.1,54.7 20.1,61.5 22.9,64.3 22.9,71.3 29.9,78.3 69.2,78.3 79.8,67.7 80.4,67.7 v81.3,66.8 | v81.3,63.6 81.3,48 81.9,47.4 v85.6,47.4
FLASH_CS
  Top 0.152: U2.P$1 16.75,55.95 18.7,54 18.7,52.8 21.7,49.8 28.4,49.8 30,48.2 32.97,48.2 U1.P$32
FLASH_MISO  (via drill 0.3)
  Top 0.152: U2.P$2 12.74,56.65 12.9,56.8 16.5,56.8 19.1,54.2 19.1,53 21.9,50.2 27.3,50.2 27.5,50.4 v27.5,50.5 | v27.6,45.5 28.6,45.5 28.9,45.2 29.8,45.2 30.35,44.65 U1.P$35
  Bottom 0.152: v27.5,50.5 27.5,45.6 v27.6,45.5
FLASH_MOSI
  Top 0.152: U2.P$5 10.21,49.9 10.6,49.5 10.8,49.5 11.1,49.2 11.1,48.7 11.9,47.9 12.8,47.9 13.8,48.9 27.9,48.9 29.5,47.3 29.5,46.9 30.5,45.9 30.5,45.3 30.65,45.15 U1.P$34
FLASH_SPCK  (via drill 0.3)
  Top 0.152: U2.P$6 11.47,48.83 12,48.3 12.7,48.3 13.7,49.3 28.2,49.3 v30.3,47.2 | U1.P$44 30.65,40.15 30.4,40.4 29.7,40.4 v29.4,40.7
  Bottom 0.152: v30.3,47.2 30.3,44.8 30.4,44.7 30.4,41.7 v29.4,40.7
GND  (via drill 0.3)
  Top 0.152: U$7.P$3 16.76,45.14 16.8,45.1 16.97,45.1 U$7.GND_PAD | U$10.P$2 70.42,25.6 U$10.P$17 70.42,26.1 U$10.P$6
  other vias: 37.9,51.7 51.7,65.9 51.7,64.5 43.2,58 42.8,66.5 51.7,63.1 51.7,61.7 51.7,60.3 51.7,58.9 51.7,57.5 51.7,56.1 27.8,73.3 27.4,32.8 31.9,31.2 33.1,28.8 53.6,38.8 50.8,35.7 55.3,35.7 49,35.2 59.8,35.6 50.5,44.5 35.3,42.9
  pour Bottom: -3.81,86.36 -3.81,-2.54 101.39,-2.44 101.39,86.46
  pour Top: -3.81,86.36 -3.81,-2.54 101.29,-2.44 101.29,86.46
  pour Top: 99.23,1.54 99.02,17.98 94.15,18.05 94.15,21.86 81.45,21.86 79.01,21.89 78.91,1.54
I2S_BCK  (via drill 0.3)
  Top 0.152: R22.1 v45.4,49.2 | v55.5,40.1 54.9,40.1 54.61,40.39 | 54.61,40.39 54.6,40.4 | U$2.10 54.61,40.39 | U$9.P$2 53.55,31.95 53.4,32.1 53.4,32.7 53.2,32.9 52.7,32.9 52.2,33.4 52.2,36.3 53.3,37.4 53.3,37.6 53.6,37.9 v54.5,37.9
  Bottom 0.152: v45.4,49.2 45.4,48 46,47.4 47.1,47.4 47.2,47.5 47.8,47.5 48.3,47 49.8,47 55.5,41.3 v55.5,40.1 55.5,38.9 v54.5,37.9
I2S_DATA
  Top 0.152: R21.1 49.45,43.95 49.7,43.7 49.7,41.1 | 49.7,41.1 50.1,40.7 50.93,40.7 U$2.5 | 49.7,41.1 49.7,35.4 50.2,34.9 51.4,34.9 51.8,34.5 51.8,33.3 52.6,32.5 52.9,32.5 53,32.4 53,32 53.7,31.3 U$9.P$3
I2S_DATA_MCU  (via drill 0.3)
  Top 0.152: U1.P$9 44.65,42.15 v44.8,42.3 | v47.5,46.8 47.5,46.45 R21.2
  Bottom 0.152: v44.8,42.3 44.8,44.1 v47.5,46.8
I2S_LR_SELECT_MCU
  Top 0.152: U1.P$20 39.57,46.77 39.4,46.6 39.4,45.6 39.7,45.3 41,45.3 41.6,45.9 41.6,46.1 42.4,46.8 42.4,47.9 42.6,48.1 R23.2
I2S_LRCK  (via drill 0.3)
  Top 0.152: R23.1 45.7,48.1 v46,48.4 | v54.3,37 53.5,37 52.6,36.1 52.6,33.5 52.8,33.3 54,33.3 54.5,32.8 U$9.P$1 | U$2.11 55.9,41.41 56.15,41.15 56.15,40.75 v56.3,40.6
  Bottom 0.152: v46,48.4 47.5,48.4 48.5,47.4 49.9,47.4 56.3,41 v56.3,40.6 56.3,38.3 55,37 v54.3,37
LCD_BACKLIGHT_PWM  (via drill 0.3)
  Top 0.152: 48.55,51.15 v48.6,51.2 48.5,51.1 R19.2 R20.1 | U1.P$3 44.25,39.15 44.7,39.6 v44.7,40.3
  Bottom 0.152: v44.7,40.3 44.7,41.1 43.9,41.9 43.9,44.7 44.6,45.4 44.6,50.3 45.4,51.1 48.5,51.1 v48.6,51.2
LED_1  (via drill 0.3)
  Top 0.152: U1.P$6 41.95,40.65 41,39.7 40.1,39.7 39.4,39 v39.4,38.3 | v30.8,21.2 R45.1
  Bottom 0.152: v39.4,38.3 39.4,29.8 v30.8,21.2
LED_2  (via drill 0.3)
  Top 0.152: U1.P$5 42.05,40.15 41.2,39.3 40.8,39.3 40.5,39 v40.5,38.3 | v39.8,20.9 R46.1
  Bottom 0.152: v40.5,38.3 40.5,21.6 v39.8,20.9
LED_3  (via drill 0.3)
  Top 0.152: U1.P$4 42.15,39.65 41.7,39.2 41.7,39 41.5,38.8 v41.5,38.3 | v48.8,20.9 R47.1
  Bottom 0.152: v41.5,38.3 41.5,22.7 43.2,21 48.7,21 v48.8,20.9
MAX98307_PUMP_VSS  (via drill 0.3)
  Top 0.152: U$10.P$14 69.92,21.8 | 69.92,21.8 C43.POS | U$10.P$7 69.92,28.08 v69.92,28.48 | v69.2,23.4 69.2,22.52 69.92,21.8
  Bottom 0.152: v69.92,28.48 69.92,23.72 69.6,23.4 v69.2,23.4
MAX98307_VCC  (via drill 0.3)
  Top 0.305: JP1.2 61.6,18.1 62.1,18.6 v63.2,18.6 | v68.2,22.7 68.2,23.8 68.83,24.43 U$10.P$13 | U$10.P$1 72.7,25.1 72.9,25.3 v72.9,25.6 72.9,25.9 72.7,26.1 U$10.P$3
  Bottom 0.305: v63.2,18.6 64.1,18.6 v68.2,22.7 69.6,22.7 72,25.1 72.4,25.1 v72.9,25.6
N$1
  Top 0.152: U$7.P$9 16.43,41.53 16.1,41.2 R2.1
N$2
  Top 0.152: U$1.P$41 34.59,52.49 SB2.P$2
N$3
  Top 0.152: U$6.NEG SPKR0.TP
N$4
  Top 0.152: U$7.P$11 R3.1
N$5
  Top 0.152: R3.2 17.42,37.11 D1.AN
N$6
  Top 0.152: U1.P$64 43.6,36.2 44.6,35.2 C14.1
N$7
  Top 0.152: U1.P$1 44.05,38.15 VREF.TP
N$8  (via drill 0.3)
  Top 0.152: U1.P$10 40.35,42.65 v40.3,42.6 | v38.5,42.2 37.6,42.2 36.1,40.7 36.1,39 35.9,38.8 34.3,38.8 31.4,35.9 31.4,35.7 31.2,35.5 AD1.TP
  Bottom 0.152: v40.3,42.6 38.9,42.6 v38.5,42.2
N$9
  Top 0.152: U1.P$52 35.07,35.17 34.1,34.2 R12.1
N$10
  Top 0.152: U$1.P$43 35.59,52.91 SB4.P$2
N$11  (via drill 0.3)
  Top 0.152: SB3.P$2 v40.2,52.1 | v35.1,55.1 U$1.P$42
  Bottom 0.152: v35.1,55.1 35.1,52.8 35.4,52.5 38.9,52.5 SB3.P$2 v40.2,52.1
N$13
  Top 0.152: J5.P$3 8,31.7 8.2,31.5 R13.2
N$15
  Top 0.152: U$4.P$31 58.11,66.81 58.6,67.3 58.6,73.3 56.5,75.4 50.4,75.4 47.54,72.54 R7.2
N$16
  Top 0.152: J5.P$2 8,32.5 8.2,32.7 R14.2
N$17
  Top 0.152: U$1.P$82 36.09,70.51 35.4,71.2 R17.2
N$18  (via drill 0.3)
  Top 0.152: U$4.P$37 U$4.P$36 U$4.P$35 U$4.P$34 U$4.P$33 | v48.3,67.6 48.4,67.6 48.6,67.8
  Top 0.305: U$4.P$33 48.51,67.81 v48.3,67.6 | U$5.P$3 v47.5,53.1
  Bottom 0.305: v48.3,67.6 51.7,67.6 52.6,66.7 52.6,53.7 52,53.1 v47.5,53.1
N$19
  Top 0.152: J5.P$1 7.9,33.3 8.3,33.7 R15.2
N$20
  Top 0.152: U$2.19 U$2.20 R1.1
N$21
  Top 0.152: U$2.1 51.63,44.37 51.5,44.5 R6.2
N$22
  Top 0.152: U$5.P$2 R18.2
N$23
  Top 0.152: U$2.16 54.61,45.46 C20.1
N$24
  Top 0.152: R19.1 43.75,50.45 44,50.2 46.35,50.2 U$5.P$1
N$25  (via drill 0.3)
  Top 0.152: SB1.P$2 30.7,51.5 v31.3,52.1 | U$1.P$40 34.09,54.91 v33.9,55.1
  Bottom 0.152: v31.3,52.1 31.3,54.6 32,55.3 33.7,55.3 v33.9,55.1
N$26
  Top 0.152: U$2.15 57.7,43.41 58.8,44.5 U$6.POS
N$27
  Top 0.152: U$2.14 57.59,42.91 59.4,41.1 U$8.POS
N$28
  Top 0.152: U$8.NEG SPRK1.TP
N$29
  Top 0.152: U1.P$19 40.07,46.77 39.9,46.6 39.9,46 40.2,45.7 40.8,45.7 41.2,46.1 41.2,46.3 41.4,46.5 41.5,46.5 42,47 42,48.4 42.8,49.2 R22.2
N$30
  Top 0.152: U1.P$59 38.57,35.23 39.5,34.3 R25.1
N$31
  Top 0.152: U$9.P$14 C41.1
N$32
  Top 0.152: C40.1 60.55,25 U$9.P$13
N$33
  Top 0.152: C41.2 63.45,26.15 64.1,26.8 64.1,27.4 64.3,27.6 64.45,27.75 R27.2
N$34
  Top 0.152: R26.2 64.05,23.35 63.45,23.95 C40.2
N$35
  Top 0.152: R26.1 R28.1 66.85,24.65 67.8,25.6 U$10.P$11
N$36
  Top 0.152: R27.1 R29.1 67.45,26.45 67.8,26.1 U$10.P$10
N$37
  Top 0.152: R28.2 66.85,23.35 67.3,23.8 67.3,24.4 68,25.1 U$10.P$12
N$38
  Top 0.152: U$9.P$9 55.6,27.4 55.9,27.1 55.9,24 55.6,23.7 C39.POS
N$39
  Top 0.152: R29.2 66.85,27.75 68,26.6 U$10.P$9
N$42
  Top 0.152: U$9.P$20 61.35,30 R31.1
N$43
  Top 0.152: R32.1 61.5,32.8 61.3,32.6 U$9.P$24
N$44
  Top 0.152: D2.AN 30.75,18.3 R45.2
N$45
  Top 0.152: D3.AN 39.75,18.3 R46.2
N$46
  Top 0.152: U$10.P$4 71.6,30 73.6,32 SPK2+.TP
N$47
  Top 0.152: U$10.P$5 70.92,30.07 69,32 SPK2-.TP
N$48
  Top 0.152: D4.AN 48.75,18.3 R47.2
N$49
  Top 0.152: SB5.P$2 9.3,72.6 8.05,71.35 J4.15
N$52
  Top 0.152: R33.1 61.4,31.7 61.15,31.95 U$9.P$23
N$53
  Top 0.152: U$10.P$15 70.42,23.57 71.2,22.8 C44.2
N$54
  Top 0.152: U$10.P$16 72.08,24.43 73.05,23.45 C44.1
PCM1789_MUTE
  Top 0.152: U$9.P$17 61.15,28.05 61.3,28.2 61.3,29.3 61.6,29.6 64.1,29.6 64.5,30 64.5,30.3 64.8,30.6 R30.1
PCM_17XX_SYSCLK  (via drill 0.3)
  Top 0.152: R25.2 39.5,28.1 40.5,27.1 v46.2,27.1 | U$9.P$5 v56.2,30 56.2,37.3 54.11,39.39 U$2.9
  Bottom 0.152: v56.2,30 52.9,30 51.4,28.5 47.6,28.5 v46.2,27.1
SAM4S_NRST  (via drill 0.3)
  Top 0.152: R24.1 SW7.P$3 | J1.P$10 8.64,15.64 9.35,16.35 SW7.P$3 | SW7.P$3 v10.8,18.4 | v10.8,23.1 SW7.P$4 11.65,25.45 14,27.8 17.5,27.8 | U1.P$39 27.05,42.65 20.3,35.9 v20.3,32.7 | 17.5,27.8 v20.3,30.6 | 17.5,27.8 17.5,26.5 18.4,25.6 v18.4,21.5 | v18.4,19.2 20.6,19.2 27,25.6 v42.9,25.6 | v51.3,32.6 51.8,32.6 53.4,31 53.4,30.8 53.55,30.65 U$9.P$4
  Bottom 0.152: v10.8,18.4 v10.8,23.1 | v20.3,30.6 v20.3,32.7 | v18.4,21.5 v18.4,19.2 | v42.9,25.6 43.2,25.6 49.4,31.8 50.5,31.8 v51.3,32.6
SERIAL_USB+  (via drill 0.3)
  Top 0.152: J3.P$3 8.03,44.27 v8.5,43.8 | U$7.P$4 13.96,44.64 v13.6,45
  Bottom 0.152: v8.5,43.8 10.3,43.8 11.5,45 v13.6,45
SERIAL_USB-
  Top 0.152: U$7.P$5 12.86,44.14 12.5,44.5 11.8,44.5 11.4,44.1 10.8,44.1 10.5,44.4 10.5,44.8 10.23,45.07 J3.P$2
SW_1  (via drill 0.3)
  Top 0.152: SW1.P$3 SW1.P$4 R34.2
  Top 0.254: SW1.P$4 14.25,10.85 15.2,11.8 21.8,11.8 22.6,12.6 22.6,14.8 v21.8,15.6 | v22.8,61.8 23.4,61.8 23.95,61.25 U$1.P$14
  Bottom 0.254: v21.8,15.6 21.8,16.4 22.6,17.2 22.6,61.6 v22.8,61.8
SW_2  (via drill 0.3)
  Top 0.152: R35.2 26,9.35 SW2.P$4 SW2.P$3
  Top 0.254: SW2.P$4 26.05,11.25 25.5,11.8 24,11.8 23.2,12.6 23.2,15.1 v22.7,15.6 | v23.4,60.7 25.19,60.7 U$1.P$15
  Bottom 0.254: v22.7,15.6 22.7,16.4 23.2,16.9 23.2,60.5 v23.4,60.7
SW_3  (via drill 0.3)
  Top 0.152: R36.2 37.8,9.35 SW3.P$4 SW3.P$3
  Top 0.254: SW3.P$3 28.75,11.65 28.1,12.3 24.2,12.3 23.8,12.7 23.8,15.4 v23.6,15.6 | U$1.P$16 24.55,60.25 v24,59.7
  Bottom 0.254: v23.6,15.6 23.6,16.4 23.8,16.6 23.8,59.5 v24,59.7
SW_4  (via drill 0.3)
  Top 0.152: R37.2 49.7,9.35 SW4.P$4 SW4.P$3
  Top 0.254: SW4.P$3 40.55,10.75 39.7,11.6 29.8,11.6 28.6,12.8 24.7,12.8 24.4,13.1 24.4,15.4 v24.6,15.6 | U$1.P$17 26.65,59.75 v26.7,59.8
  Bottom 0.254: v24.6,15.6 24.6,16.4 24.4,16.6 24.4,58.91 U$1.P$17 26.65,59.75 v26.7,59.8
SW_5  (via drill 0.3)
  Top 0.152: R38.2 61.4,9.35 SW5.P$4 SW5.P$3
  Top 0.254: SW5.P$3 52.35,10.45 52,10.8 41.2,10.8 39.9,12.1 30.1,12.1 28.9,13.3 25.2,13.3 25,13.5 25,15.1 v25.5,15.6 | U$1.P$18 26.25,59.25 26.4,59.1 v27.4,59.1
  Bottom 0.254: v25.5,15.6 25.5,16.4 25,16.9 25,57.8 26.3,59.1 v27.4,59.1
SW_6  (via drill 0.3)
  Top 0.152: R39.2 73.6,9.35 SW6.P$4 SW6.P$3
  Top 0.254: SW6.P$3 64.55,10.55 64.2,10.9 52.8,10.9 52.4,11.3 41.6,11.3 40.3,12.6 30.4,12.6 29.2,13.8 25.8,13.8 25.6,14 25.6,14.8 v26.4,15.6 | U$1.P$19 25.95,58.75 26.2,58.5 26.5,58.5 v26.7,58.3
  Bottom 0.254: v26.4,15.6 26.4,16.3 25.6,17.1 25.6,57.3 26.6,58.3 v26.7,58.3
SWCLK  (via drill 0.3)
  Top 0.152: J1.P$4 8.05,19.45 8.9,20.3 19.8,20.3 29.2,29.7 30.6,29.7 v30.8,29.9 | U1.P$53 35.57,37.77 v35.6,37.8
  Bottom 0.152: v35.6,37.8 35.6,30.6 34.9,29.9 v30.8,29.9
SWDIO
  Top 0.152: U1.P$51 34.57,35.37 34.4,35.2 34,35.2 33.6,34.8 33.5,34.7 19.52,20.72 J1.P$2
SWO/TDO  (via drill 0.3)
  Top 0.152: J1.P$6 7.38,18.18 9.1,19.9 20,19.9 28.8,28.7 29.8,28.7 v29.9,28.8 | v32.9,35.1 32.9,35.53 U1.P$49
  Bottom 0.152: v29.9,28.8 29.9,32.1 v32.9,35.1
TWCK0  (via drill 0.3)
  Top 0.152: U$1.P$86 34.09,68.39 v33.5,67.8 | v29.7,44.3 29.85,44.15 U1.P$36 33.15,44.15 33.6,43.7 36.7,43.7 v37.3,44.3 | U$2.4 50.7,41.91 v50.4,41.6 | U$9.P$22 v57.9,31.3 57.6,31 R5.1
  Bottom 0.152: v29.7,44.3 28.1,45.9 28.1,54.3 30.6,56.8 32.7,56.8 33.5,57.6 v33.5,67.8 | 50.3,41.5 47.9,39.1 38.9,39.1 37.3,40.7 v37.3,44.3 | 50.3,41.5 v50.4,41.6 | 50.3,41.5 50.3,37.4 54,33.7 57.2,33.7 57.6,33.3 57.6,31.6 v57.9,31.3
TWD0  (via drill 0.3)
  Top 0.152: U$2.3 50.8,42.41 v50.4,42.8 | v28.6,42 29.1,42 30.2,40.9 30.4,40.9 30.65,40.65 U1.P$43 34.95,40.65 v38,43.7 | v32.9,65.9 33.8,65.9 34.59,66.69 U$1.P$85 | U$9.P$21 58.85,30.65 v58.7,30.5 58,29.8 58,24.2 58.7,23.5 R4.1
  Bottom 0.152: v28.6,42 28.6,43.5 26.9,45.2 26.9,50.9 27.3,51.3 27.4,51.3 27.7,51.6 27.7,54.6 30.3,57.2 32.4,57.2 33.1,57.9 33.1,65.7 v32.9,65.9 | v58.7,30.5 58.7,32.2 58,32.9 58,33.6 57.4,34.2 54.2,34.2 51.1,37.3 51.1,41.9 50.4,42.6 v50.4,42.8 47.2,39.6 39,39.6 37.7,40.9 37.7,43.4 v38,43.7 37.9,43.6
URXD0  (via drill 0.3)
  Top 0.152: U$7.P$26 16.93,48.13 | 16.93,48.13 17.1,48.3 24.3,48.3 25.5,47.1 v28.7,47.1 | v32.7,47.3 32.7,46.4 34.5,44.6 35.3,44.6 35.6,44.9 35.6,45.8 35.4,46 35.2,46 34.57,46.63 U1.P$30 | 16.93,48.13 16.37,48.13 v16.3,48.2 | v20.5,42 22.5,42 TP_URXDO.TP
  Bottom 0.152: v28.7,47.1 28.7,47.2 29.9,48.4 31.9,48.4 32.7,47.6 v32.7,47.3 | v16.3,48.2 16.3,46.2 v20.5,42
UTXD0  (via drill 0.3)
  Top 0.152: U$7.P$25 17.43,47.63 17.6,47.8 22,47.8 | 22,47.8 22.6,47.2 TP_UTXD0.TP | 22,47.8 24.2,47.8 25.3,46.7 28.2,46.7 28.7,46.2 v29.3,46.2 | U1.P$29 35.07,46.63 35.3,46.4 35.6,46.4 36,46 36,44.4 35.7,44.1 33.8,44.1 v33.1,44.8
  Bottom 0.152: v29.3,46.2 29.3,47.2 30.1,48 31,48 33,46 33,44.9 v33.1,44.8
V_WALL_WART
  Top 0.61: 3.3_V_REG.P$4 90.34,10.66 88.8,12.2 86.9,12.2 85.35,13.75 85.5,13.9 85.5,15.48 J2.PWR C1.1 82.1,14.1 79.88,11.88 5.0_V_REG.P$4
VBUS  (via drill 0.3)
  Top 0.305: J3.P$1 5.23,45.87 v5.2,45.9 | v14.3,42.4 15.2,42.4 | 15.2,42.4 15.77,42.4 U$7.P$8 | U$7.P$7 15.03,42.57 15.2,42.4
  Top 0.406: v14.3,42.4 C18.1 C17.1
  Bottom 0.305: v5.2,45.9 5.2,44.5 7.3,42.4 v14.3,42.4
VBUS_DETECT
  Top 0.152: R15.1 R16.2 10.35,36.15 11,35.5 11,34.6 11.8,33.8 18.1,33.8 18.8,34.5 18.8,35.2 26.75,43.15 U1.P$38
VDDOUT
  Top 0.152: U1.P$8 43.27,41.65 45.7,41.65 C6.1 47.5,42.15 C7.1 | 44.95,43.65 45.3,44 45.3,44.35 C11.1 | U1.P$24 C8.1 | U1.P$54 36.07,34.74 35.47,34.14 C12.1
  Top 0.254: 44.95,43.65 U1.P$12 39.55,43.65 | U1.P$24 37.57,46.03 39.55,43.65 | U1.P$54 36.07,37.17 36.6,37.7 36.6,39.9 37,40.3 38,40.3 39.35,41.65 39.55,41.65 | 39.55,41.65 39.55,43.65 | 43.27,41.65 39.55,41.65
XIN
  Top 0.152: U1.P$62 40.07,35.13 40.3,34.9 43.6,34.9 44.16,34.34 U$3.P$1 C2.1
XOUT
  Top 0.152: C3.1 41.86,30.2 U$3.P$3 40.77,31.73 40.6,31.9 40.6,34.1 39.57,35.13 U1.P$61

## Text on the board
tPlace: Connect JTAG to / \PROGRAMn | Serial port | USB | SAM4S reset | 3.3v | 5.0v